# Altium project LogicsOnly.PrjPcb
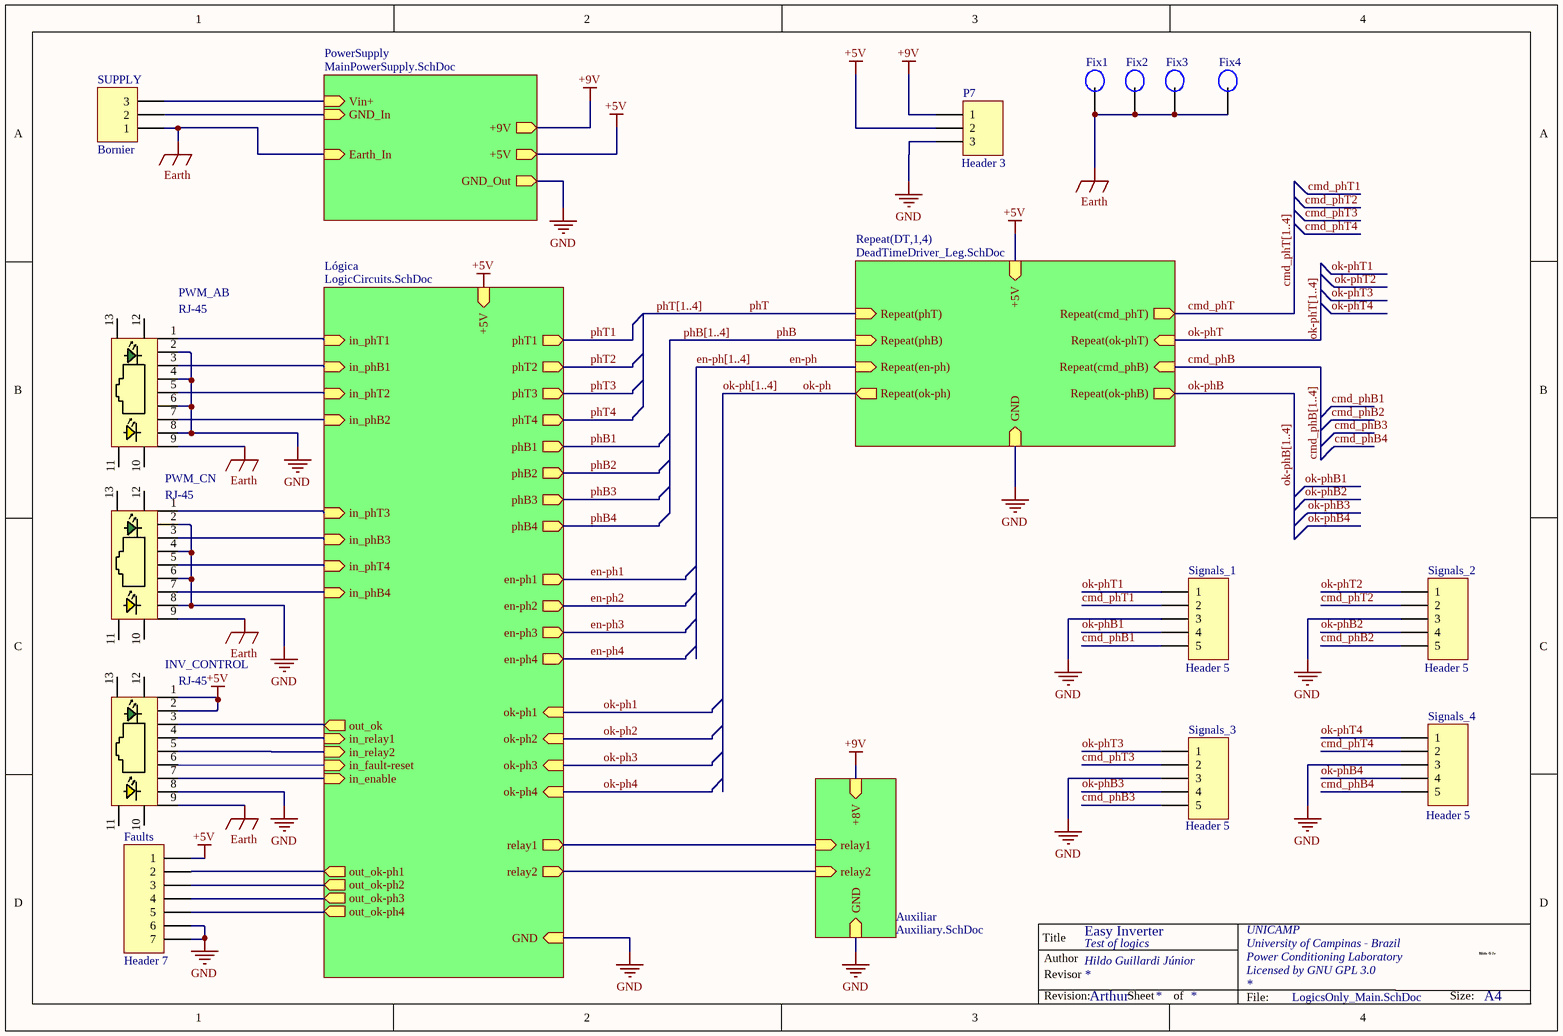
[diagram p0: LogicsOnly_Main.SchDoc]
5 sheets, 236 parts. Net scope: hierarchical (ports join the sheet entries above them; power ports are global).
Board file: LogicsOnly.PcbDoc
Sheets:
  LogicsOnly_Main.SchDoc
    Lógica = LogicCircuits.SchDoc
    Auxiliar = Auxiliary.SchDoc
    DT1 = DeadTimeDriver_Leg.SchDoc
    DT2 = DeadTimeDriver_Leg.SchDoc
    DT3 = DeadTimeDriver_Leg.SchDoc
    DT4 = DeadTimeDriver_Leg.SchDoc
    PowerSupply = MainPowerSupply.SchDoc

## Sheet LogicsOnly_Main.SchDoc: Test of logics
size A4; Author: Hildo Guillardi Júnior; Organization: UNICAMP; Address1: University of Campinas - Brazil; Address2: Power Conditioning Laboratory; Address3: Licensed by GNU GPL 3.0; Revision: Arthur; ProjectName: Easy Inverter

### Parts
Faults  value Header 7
Fix1  (no value)  [Pino]
Fix2  (no value)  [Pino]
Fix3  (no value)  [Pino]
Fix4  (no value)  [Pino]
INV_CONTROL  value RJ-45  [RJ-45]
P7  value Header 3  [HDR1X3]
PWM_AB  value RJ-45  [RJ-45]
PWM_CN  value RJ-45  [RJ-45]
Signals_1  value Header 5  [HDR1X5]
Signals_2  value Header 5  [HDR1X5]
Signals_3  value Header 5  [HDR1X5]
Signals_4  value Header 5  [HDR1X5]
SUPPLY  value Bornier  [3 Pin  Borner]

### Sub-sheets
Auxiliar = Auxiliary.SchDoc: relay1 (in), relay2 (in), GND (in), +8V (in)
Lógica = LogicCircuits.SchDoc: +5V (in), GND (in), out_ok-ph1 (out), out_ok-ph2 (out), ok-ph1 (in), out_ok-ph3 (out), out_ok-ph4 (out), en-ph1 (out), en-ph2 (out), en-ph3 (out), en-ph4 (out), in_enable (in), in_fault-reset (in), in_relay1 (in), relay1 (out), relay2 (out), out_ok (out), ok-ph2 (in), ok-ph3 (in), ok-ph4 (in), phB1 (out), phB2 (out), phT1 (out), phT2 (out), phT3 (out), phB3 (out), phT4 (out), phB4 (out), in_phT1 (in), in_phB1 (in), in_phT2 (in), in_phB2 (in), in_phT4 (in), in_phB4 (in), in_phT3 (in), in_phB3 (in), in_relay2 (in)
PowerSupply = MainPowerSupply.SchDoc: Earth_In (in), +9V (out), +5V (out), GND_Out (out), GND_In (in), Vin+ (in)
Repeat(DT,1,4) = DeadTimeDriver_Leg.SchDoc: Repeat(ok-ph) (out), Repeat(cmd_phT) (out), Repeat(phB) (in), Repeat(ok-phT) (in), Repeat(phT) (in), GND (in), +5V (in), Repeat(ok-phB) (out), Repeat(en-ph) (in), Repeat(cmd_phB) (in)

### Nets
+5V: Faults.1 INV_CONTROL.1 INV_CONTROL.2 P7.2 ; sheet Lógica/+5V, sheet Repeat(DT,1,4)/+5V, sheet PowerSupply/+5V
+9V: P7.1 ; sheet Auxiliar/+8V, sheet PowerSupply/+9V
Earth: Fix1.0 Fix2.0 Fix3.0 Fix4.0 INV_CONTROL.9 PWM_AB.9 PWM_CN.9 SUPPLY.1 ; sheet PowerSupply/Earth_In
GND: Faults.6 Faults.7 INV_CONTROL.8 P7.3 PWM_AB.2 PWM_AB.4 PWM_AB.6 PWM_AB.8 PWM_CN.2 PWM_CN.4 PWM_CN.6 PWM_CN.8 Signals_1.3 Signals_2.3 Signals_3.3 Signals_4.3 SUPPLY.2 ; sheet Lógica/GND, sheet Auxiliar/GND, sheet Repeat(DT,1,4)/GND, sheet PowerSupply/GND_Out, sheet PowerSupply/GND_In  [project net 0]
cmd_phB: sheet Repeat(DT,1,4)/Repeat(cmd_phB)
cmd_phB1: Signals_1.5
cmd_phB2: Signals_2.5
cmd_phB3: Signals_3.5
cmd_phB4: Signals_4.5
cmd_phT: sheet Repeat(DT,1,4)/Repeat(cmd_phT)
cmd_phT1: Signals_1.2
cmd_phT2: Signals_2.2
cmd_phT3: Signals_3.2
cmd_phT4: Signals_4.2
en-ph: sheet Repeat(DT,1,4)/Repeat(en-ph)
en-ph1: sheet Lógica/en-ph1, sheet Lógica/en-ph2  [also labelled en-ph2]
en-ph3: sheet Lógica/en-ph3, sheet Lógica/en-ph4  [also labelled en-ph4]
ok-ph: sheet Repeat(DT,1,4)/Repeat(ok-ph)
ok-phB: sheet Repeat(DT,1,4)/Repeat(ok-phB)
ok-phB1: Signals_1.4
ok-phB2: Signals_2.4
ok-phB3: Signals_3.4
ok-phB4: Signals_4.4
ok-phT: sheet Repeat(DT,1,4)/Repeat(ok-phT)
ok-phT1: Signals_1.1
ok-phT2: Signals_2.1
ok-phT3: Signals_3.1
ok-phT4: Signals_4.1
phB: sheet Repeat(DT,1,4)/Repeat(phB)
phT: sheet Repeat(DT,1,4)/Repeat(phT)
NetCin3_1: SUPPLY.3 ; sheet PowerSupply/Vin+
NetFaults_2: Faults.2 ; sheet Lógica/out_ok-ph1
NetFaults_3: Faults.3 ; sheet Lógica/out_ok-ph2
NetFaults_4: Faults.4 ; sheet Lógica/out_ok-ph3
NetFaults_5: Faults.5 ; sheet Lógica/out_ok-ph4
NetINV_CONTROL_3: INV_CONTROL.3 ; sheet Lógica/out_ok
NetINV_CONTROL_4: INV_CONTROL.4 ; sheet Lógica/in_relay1
NetINV_CONTROL_5: INV_CONTROL.5 ; sheet Lógica/in_relay2
NetINV_CONTROL_6: INV_CONTROL.6 ; sheet Lógica/in_fault-reset
NetINV_CONTROL_7: INV_CONTROL.7 ; sheet Lógica/in_enable
NetPWM_AB_1: PWM_AB.1 ; sheet Lógica/in_phT1
NetPWM_AB_3: PWM_AB.3 ; sheet Lógica/in_phB1
NetPWM_AB_5: PWM_AB.5 ; sheet Lógica/in_phT2
NetPWM_AB_7: PWM_AB.7 ; sheet Lógica/in_phB2
NetPWM_CN_1: PWM_CN.1 ; sheet Lógica/in_phT3
NetPWM_CN_3: PWM_CN.3 ; sheet Lógica/in_phB3
NetPWM_CN_5: PWM_CN.5 ; sheet Lógica/in_phT4
NetPWM_CN_7: PWM_CN.7 ; sheet Lógica/in_phB4
NetR2_1: sheet Lógica/relay1, sheet Auxiliar/relay1
NetR4_1: sheet Lógica/relay2, sheet Auxiliar/relay2

Not connected (* = marked no-connect by the designer): INV_CONTROL 10 11 12 13; PWM_AB 10 11 12 13; PWM_CN 10 11 12 13

### Buses and harness runs
bus cmd_phB[1..4]
bus cmd_phT[1..4]
bus en-ph[1..4]
bus ok-ph[1..4]
bus ok-phB[1..4]
bus ok-phT[1..4]
bus phB[1..4]
bus phT[1..4]

### Notes on the sheet
- Title
- Author
- Revisor
- Hildo G Jr
- Revision:
- Sheet
- of
- File:
- Size:
- A4
- HGJr

### Library data of the parts
Faults = Header 7: Header, 7-Pin
Fix1-Fix4 = Pino: Value: Pin
INV_CONTROL PWM_AB PWM_CN = RJ-45: pn: A-2004-2-4-LPS-N-R
P7 = Header 3: Header, 3-Pin
Signals_1-Signals_4 = Header 5: Header, 5-Pin
SUPPLY = Header 3: Header, 3-Pin; pn: 1935174

## Sheet LogicCircuits.SchDoc: Logic circuits
size A4; CheckedBy: Joel Guerreiro; Author: Hildo Guillardi Júnior; Organization: UNICAMP / LCEE; Address1: University of Campinas - Brazil; Address2: Power Conditioning Laboratory; Address3: Licensed by GNU GPL 3.0; Revision: Joel Guerreiro; ProjectName: Easy Inverter
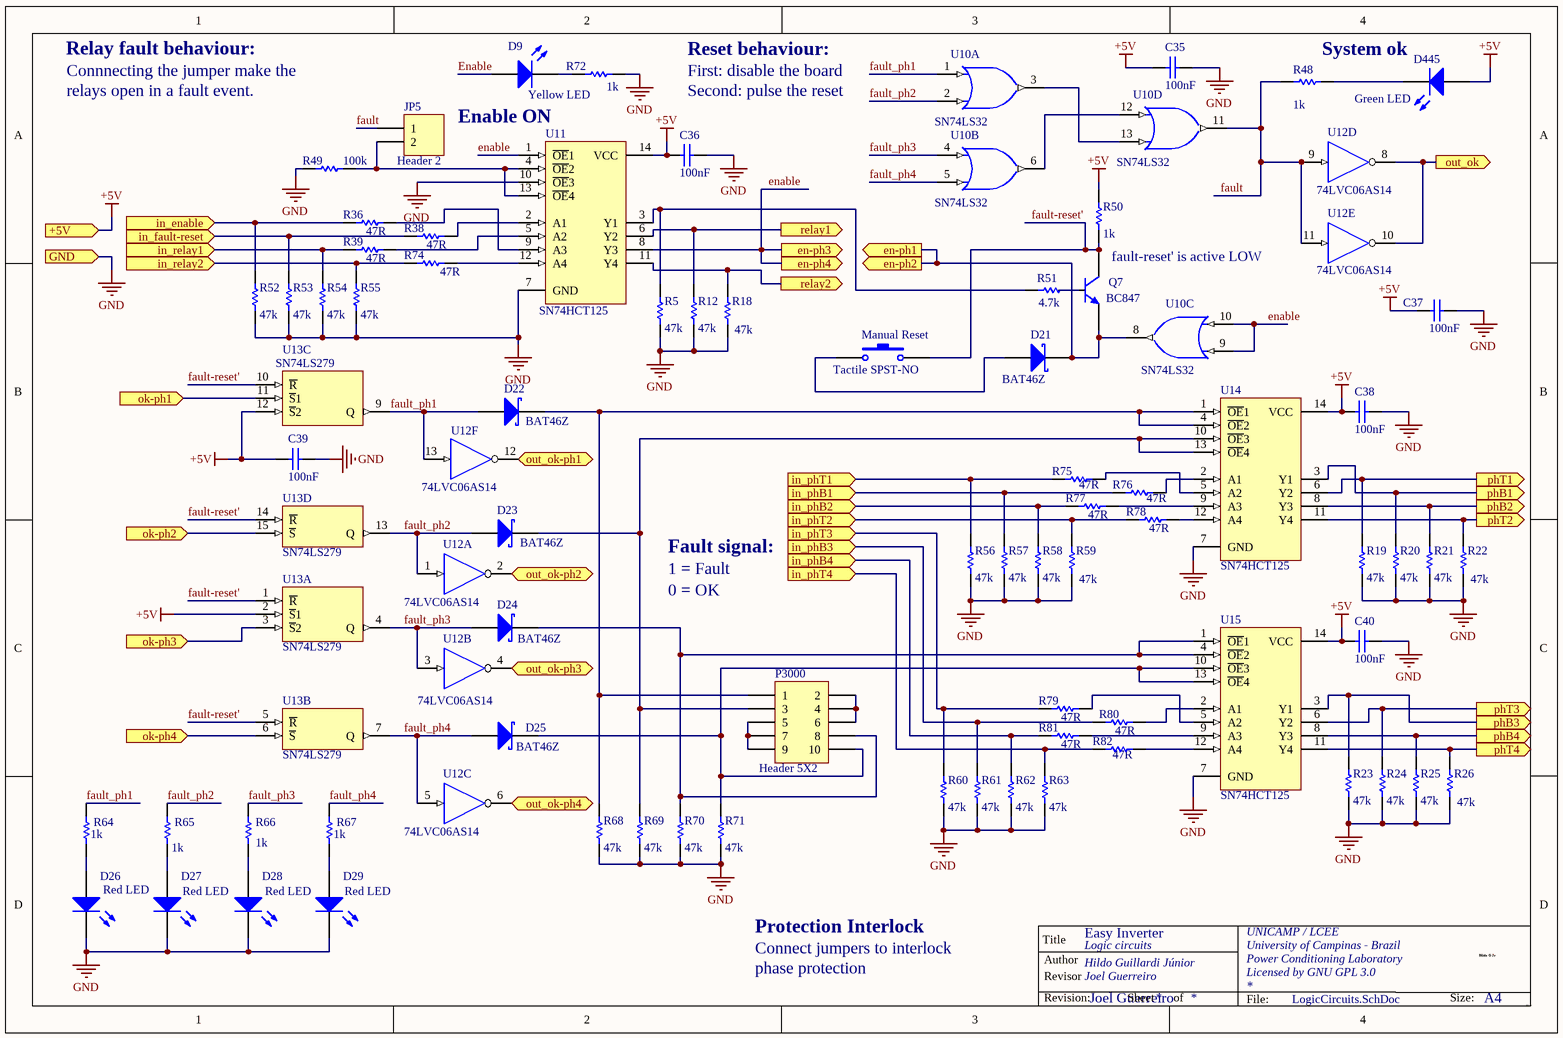
[diagram p1: LogicCircuits.SchDoc]

### Parts
C35  value 100nF  [0805_W]
C36  value 100nF  [0805_W]
C37  value 100nF  [0805_W]
C38  value 100nF  [0805_W]
C39  value 100nF  [0805_W]
C40  value 100nF  [0805_W]
D9  value Yellow LED  [LED_0805]
D21  value BAT46Z  [SOD-123]
D22  value BAT46Z  [SOD-123]
D23  value BAT46Z  [SOD-123]
D24  value BAT46Z  [SOD-123]
D25  value BAT46Z  [SOD-123]
D26  value Red LED  [LED_0805]
D27  value Red LED  [LED_0805]
D28  value Red LED  [LED_0805]
D29  value Red LED  [LED_0805]
D445  value Green LED  [LED_0805]
JP5  value Header 2  [HDR1X2]
Manual_Reset  value Tactile SPST-NO  [Tactile SPST-NO]
P3000  value Header 5X2  [HDR2X5]
Q7  value BC847  [SOT-23-TT3_N]
R5  value 47k  [0805_W]
R12  value 47k  [0805_W]
R18  value 47k  [0805_W]
R19  value 47k  [0805_W]
R20  value 47k  [0805_W]
R21  value 47k  [0805_W]
R22  value 47k  [0805_W]
R23  value 47k  [0805_W]
R24  value 47k  [0805_W]
R25  value 47k  [0805_W]
R26  value 47k  [0805_W]
R36  value 47R  [0805_W]
R38  value 47R  [0805_W]
R39  value 47R  [0805_W]
R48  value 1k  [0805_W]
R49  value 100k  [0805_W]
R50  value 1k  [0805_W]
R51  value 4.7k  [0805_W]
R52  value 47k  [0805_W]
R53  value 47k  [0805_W]
R54  value 47k  [0805_W]
R55  value 47k  [0805_W]
R56  value 47k  [0805_W]
R57  value 47k  [0805_W]
R58  value 47k  [0805_W]
R59  value 47k  [0805_W]
R60  value 47k  [0805_W]
R61  value 47k  [0805_W]
R62  value 47k  [0805_W]
R63  value 47k  [0805_W]
R64  value 1k  [0805_W]
R65  value 1k  [0805_W]
R66  value 1k  [0805_W]
R67  value 1k  [0805_W]
R68  value 47k  [0805_W]
R69  value 47k  [0805_W]
R70  value 47k  [0805_W]
R71  value 47k  [0805_W]
R72  value 1k  [0805_W]
R74  value 47R  [0805_W]
R75  value 47R  [0805_W]
R76  value 47R  [0805_W]
R77  value 47R  [0805_W]
R78  value 47R  [0805_W]
R79  pn: 47R  [0805_W]
R80  value 47R  [0805_W]
R81  value 47R  [0805_W]
R82  value 47R  [0805_W]
U10  value SN74LS32  [SO14-Wide]  (parts A,B,C,D of 4)
U11  value SN74HCT125  [SO14-Wide]
U12  value 74LVC06AS14  [SOIC-14N]  (parts A,B,C,D,E,F of 6)
U13  value SN74LS279  (parts A,B,C,D of 4)
U14  value SN74HCT125  [SO14-Wide]
U15  value SN74HCT125  [SO14-Wide]

### Ports
+5V (in), en-ph1 (out), en-ph2 (out), en-ph3 (out), en-ph4 (out), GND (in), in_enable (in), in_fault-reset (in), in_phB1 (in), in_phB2 (in), in_phB3 (in), in_phB4 (in), in_phT1 (in), in_phT2 (in), in_phT3 (in), in_phT4 (in), in_relay1 (in), in_relay2 (in), ok-ph1 (in), ok-ph2 (in), ok-ph3 (in), ok-ph4 (in), out_ok (out), out_ok-ph1 (out), out_ok-ph2 (out), out_ok-ph3 (out), out_ok-ph4 (out), phB1 (out), phB2 (out), phB3 (out), phB4 (out), phT1 (out), phT2 (out), phT3 (out), phT4 (out), relay1 (out), relay2 (out)

### Nets
+5V: C35.1 C36.1 C37.1 C38.1 C39.1 C40.1 D445.1(A) R50.2 U10.14(VCC) U11.14(VCC) U12.14(VCC) U13.2(~{S}1) U13.12(~{S}2) U13.16(VCC) U14.14(VCC) U15.14(VCC) ; port +5V
GND: C35.2 C36.2 C37.2 C38.2 C39.2 C40.2 D26.2(K) D27.2(K) D28.2(K) D29.2(K) R5.1 R12.1 R18.1 R19.1 R20.1 R21.1 R22.1 R23.1 R24.1 R25.1 R26.1 R49.2 R52.1 R53.1 R54.1 R55.1 R56.1 R57.1 R58.1 R59.1 R60.1 R61.1 R62.1 R63.1 R68.1 R69.1 R70.1 R71.1 R72.2 U10.7(GND) U11.7(GND) U11.10(~{OE}3) U12.7(GND) U13.8(GND) U14.7(GND) U15.7(GND) ; port GND  [project net 0]
en-ph1: D21.2(K) Q7.2(E) U10.8(3Y) ; port en-ph1, port en-ph2
enable: D9.1(A) U10.9(3A) U10.10(3B) U11.1(~{OE}1) U11.8(Y3) ; port en-ph3, port en-ph4  [project net en-ph3]
fault: JP5.1 R48.1 U10.11(4Y) U12.9(4A) U12.11(5A)
fault-reset': Manual_Reset.1 Q7.3(C) R50.1 U13.1(~{R}) U13.5(~{R}) U13.10(~{R}) U13.14(~{R})
fault_ph1: D22.1(A) R64.2 U10.1(1A) U12.13(6A) U13.9(Q)
fault_ph2: D23.1(A) R65.2 U10.2(1B) U12.1(1A) U13.13(Q)
fault_ph3: D24.1(A) R66.2 U10.4(2A) U12.3(2A) U13.4(Q)
fault_ph4: D25.1(A) R67.2 U10.5(2B) U12.5(3A) U13.7(Q)
ok-ph1: U13.11(~{S}1) ; port ok-ph1
ok-ph2: U13.15(~{S}) ; port ok-ph2
ok-ph3: U13.3(~{S}2) ; port ok-ph3
ok-ph4: U13.6(~{S}) ; port ok-ph4
phB: R20.2 U14.3(Y1) ; port phB1
phB: R21.2 U14.8(Y3) ; port phB2  [a separate net that carries the same name]
phB: R23.2 U15.3(Y1) ; port phB3  [a separate net that carries the same name]
phB: R25.2 U15.8(Y3) ; port phB4  [a separate net that carries the same name]
phT: R22.2 U14.11(Y4) ; port phT2
phT: R19.2 U14.6(Y2) ; port phT1  [a separate net that carries the same name]
phT: R26.2 U15.11(Y4) ; port phT4  [a separate net that carries the same name]
phT: R24.2 U15.6(Y2) ; port phT3  [a separate net that carries the same name]
NetD9_2: D9.2(K) R72.1
NetD21_1: D21.1(A) Manual_Reset.2
NetD22_2: D22.2(K) P3000.1 R68.2 U14.1(~{OE}1) U14.4(~{OE}2)
NetD23_2: D23.2(K) P3000.3 R69.2 U14.10(~{OE}3) U14.13(~{OE}4)
NetD24_2: D24.2(K) P3000.8 R70.2 U15.1(~{OE}1) U15.4(~{OE}2)
NetD25_2: D25.2(K) P3000.10 R71.2 U15.10(~{OE}3) U15.13(~{OE}4)
NetD26_1: D26.1(A) R64.1
NetD27_1: D27.1(A) R65.1
NetD28_1: D28.1(A) R66.1
NetD29_1: D29.1(A) R67.1
NetD445_2: D445.2(K) R48.2
NetFaults_2: U12.12(6~{Y}) ; port out_ok-ph1
NetFaults_3: U12.2(1~{Y}) ; port out_ok-ph2
NetFaults_4: U12.4(2~{Y}) ; port out_ok-ph3
NetFaults_5: U12.6(3~{Y}) ; port out_ok-ph4
NetINV_CONTROL_3: U12.8(4~{Y}) U12.10(5~{Y}) ; port out_ok
NetINV_CONTROL_4: R39.2 R54.2 ; port in_relay1
NetINV_CONTROL_5: R55.2 R74.2 ; port in_relay2
NetINV_CONTROL_6: R38.2 R53.2 ; port in_fault-reset
NetINV_CONTROL_7: R36.2 R52.2 ; port in_enable
NetJP5_2: JP5.2 R49.1 U11.4(~{OE}2) U11.13(~{OE}4)
NetP3000_2: P3000.2 P3000.4 P3000.6
NetP3000_5: P3000.5 P3000.7 P3000.9
NetPWM_AB_1: R56.2 R75.2 ; port in_phT1
NetPWM_AB_3: R57.2 R76.2 ; port in_phB1
NetPWM_AB_5: R59.2 R78.2 ; port in_phT2
NetPWM_AB_7: R58.2 R77.2 ; port in_phB2
NetPWM_CN_1: R60.2 R79.2 ; port in_phT3
NetPWM_CN_3: R61.2 R80.2 ; port in_phB3
NetPWM_CN_5: R63.2 R82.2 ; port in_phT4
NetPWM_CN_7: R62.2 R81.2 ; port in_phB4
NetQ7_1: Q7.1(B) R51.2
NetR2_1: R12.2 U11.6(Y2) ; port relay1
NetR4_1: R18.2 U11.11(Y4) ; port relay2
NetR5_2: R5.2 R51.1 U11.3(Y1)
NetR36_1: R36.1 U11.9(A3)
NetR38_1: R38.1 U11.2(A1)
NetR39_1: R39.1 U11.5(A2)
NetR74_1: R74.1 U11.12(A4)
NetR75_1: R75.1 U14.5(A2)
NetR76_1: R76.1 U14.2(A1)
NetR77_1: R77.1 U14.9(A3)
NetR78_1: R78.1 U14.12(A4)
NetR79_1: R79.1 U15.5(A2)
NetR80_1: R80.1 U15.2(A1)
NetR81_1: R81.1 U15.9(A3)
NetR82_1: R82.1 U15.12(A4)
NetU10_3: U10.3(1Y) U10.13(4B)
NetU10_6: U10.6(2Y) U10.12(4A)

### Notes on the sheet
- Relay fault behaviour:
- Connnecting the jumper make the
- relays open in a fault event.
- Reset behaviour:
- First: disable the board
- Second: pulse the reset
- System ok
- Enable ON
- fault-reset' is active LOW
- Fault signal:
- 1 = Fault
- 0 = OK
- Protection Interlock
- Connect jumpers to interlock
- phase protection
- Title
- Author
- Revisor
- Hildo G Jr
- Revision:
- Sheet
- of
- File:
- Size:
- A4
- HGJr

### Library data of the parts
C35 C36 = Capacitor_nao_polarizado: Capacitor nao polarizado; Value: Value
C37-C40 = Capacitor_nao_polarizado: Capacitor nao polarizado; pn: C0805C104K8RACTU
D9 = LED0: Typical INFRARED GaAs LED; pn: SML-LXR85YC-TR
D21 D23-D25 = D Schottky: Schottky Diode; np: BAT46ZFILM
D22 = D Schottky: Schottky Diode; pn: BAT46ZFILM
D26-D29 = LED0: Typical INFRARED GaAs LED; pn: SML-LXR85IC-TR
D445 = LED0: Typical INFRARED GaAs LED; pn: SML-LXR85GC-TR
JP5 = Header 2: Header, 2-Pin
Manual_Reset = SW-PB: Switch; pn: FSM4JH
P3000 = Header 5X2: Header, 5-Pin, Dual row
Q7 = BC847: NPN General-purpose Transistor; pn: BC847BLT1G
R5 R12 R18-R26 R52-R55 R68-R71 = Res_0805: Resistor; pn: RMCF0805JT47K0
R36 R38 R39 R74-R78 R80-R82 = Res_0805: Resistor; pn: RMCF0805JT47R0
R48 R50 R64-R67 R72 = Res_0805: Resistor; pn: RMCF0805JT1K00
R49 R56-R63 = Res_0805: Resistor; Manufacturer: Generic Components; Class: Passive; Published: 08/06/2000; Publisher: Altium Hobart Technology Centre; SubClass: Resistor; Value: Value
R51 = Res_0805: Resistor; pn: RMCF0805JT4K70
R79 = Res_0805: Resistor; Published: RMCF0805JT47R0
U10 = HD74HC32FP: Quad 2-Input OR Gates; pn: SN74LS32NSR
U11 = M74HC125M1R: Quad Bus Buffer (3-State); pn: SN74HCT125DR
U12 = HD74LV06AFP: Hex Inverter Buffers / Drivers with Open Drain Outputs; Publisher: 74LVC06AS14-13
U13 = SN74LS279AD: Quadruple S-R Latches; pn: SN74LS279ANSR
U14 U15 = M74HC125M1R: Quad Bus Buffer (3-State); Publisher: SN74HCT125DR

## Sheet Auxiliary.SchDoc: Relays & auxiliary circuits
size A4; CheckedBy: Fellipe; Author: Hildo Guillardi Júnior; Organization: UNICAMP / LCEE; Address1: University of Campinas - Brazil; Address2: Power Conditioning Laboratory; Address3: Licensed by GNU GPL 3.0; ProjectName: Easy Inverter
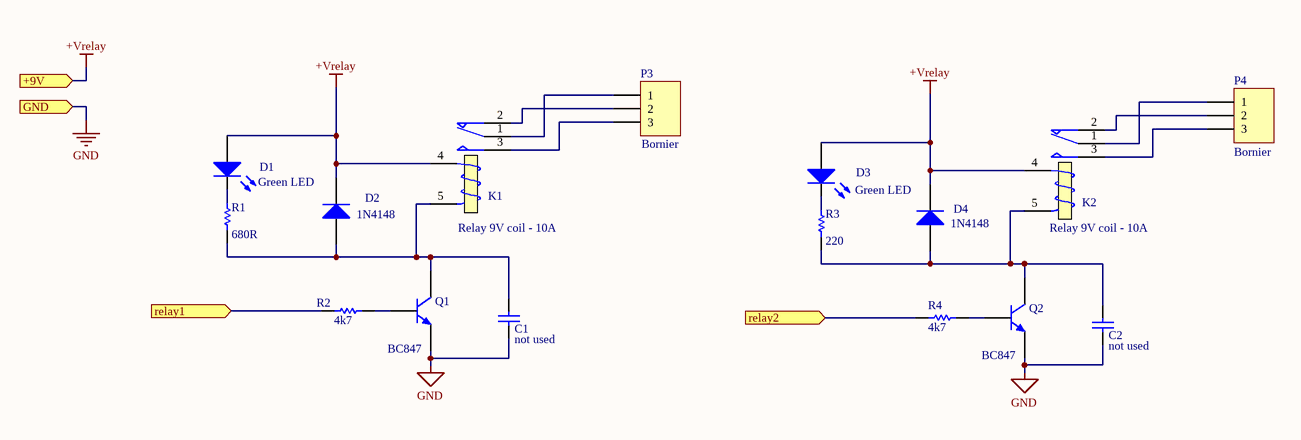
[diagram p2: Auxiliary.SchDoc]

### Parts
C1  value not used  [0805_W]
C2  value not used  [0805_W]
D1  value Green LED  [LED_0805]
D2  value 1N4148  [SOD-123]
D3  value Green LED  [LED_0805]
D4  value 1N4148  [SOD-123]
K1  value Relay 9V coil - 10A  [Relay - SPDT]
K2  value Relay 9V coil - 10A  [Relay - SPDT]
P3  value Bornier  [KK-3_G]
P4  value Bornier  [KK-3_G]
Q1  value BC847  [SOT-23-TT3_L]
Q2  value BC847  [SOT-23-TT3_L]
R1  value 680R  [0805_W]
R2  value 4k7  [0805_W]
R3  value 220  [0805_W]
R4  value 4k7  [0805_W]

### Ports
+9V (in), GND (in), relay1 (in), relay2 (in)

### Nets
+Vrelay: D1.1(A) D2.2(K) D3.1(A) D4.2(K) K1.4(T1) K2.4(T1) ; port +9V
GND: C1.1 C2.1 Q1.2(E) Q2.2(E) ; port GND  [project net 0]
NetC1_2: C1.2 D2.1(A) K1.5(T2) Q1.3(C) R1.2
NetC2_2: C2.2 D4.1(A) K2.5(T2) Q2.3(C) R3.2
NetD1_2: D1.2(K) R1.1
NetD3_2: D3.2(K) R3.1
NetK1_1: K1.1(COM) P3.1
NetK1_2: K1.2(NC) P3.2
NetK1_3: K1.3(NO) P3.3
NetK2_1: K2.1(COM) P4.1
NetK2_2: K2.2(NC) P4.2
NetK2_3: K2.3(NO) P4.3
NetQ1_1: Q1.1(B) R2.2
NetQ2_1: Q2.1(B) R4.2
NetR2_1: R2.1 ; port relay1
NetR4_1: R4.1 ; port relay2

### Notes on the sheet
- Title
- Author
- Revisor
- Hildo G Jr
- Revision:
- Sheet
- of
- File:
- Size:
- A4
- HGJr

### Library data of the parts
C1 C2 = Cap: Capacitor
D1 D3 = LED0: as D445 on sheet LogicCircuits
D2 D4 = Diode 1N4148: High Conductance Fast Diode; pn: 1N4148W-TP
K1 K2 = Relay: SPDT Relay; pn: G5LE-14-DC9
P3 P4 = Header 3: Header, 3-Pin; pn: 1935174
Q1 Q2 = BC847: as Q7 on sheet LogicCircuits
R1 R3 = Res_0805: Resistor; pn: RMCF0805JT680R
R2 R4 = Res1: Resistor; pn: RMCF0805JT4K70

## Sheet DeadTimeDriver_Leg.SchDoc: Dead time & interlock
size A4; CheckedBy: Hildo / Joel; Author: Fellipe; Organization: UNICAMP / LCEE; Address1: University of Campinas - Brazil; Address2: Power Conditioning Laboratory; Address3: Licensed by GNU GPL 3.0; ProjectName: Easy Inverter
Used 4 times, as channels DT1, DT2, DT3, DT4. Parts and nets are listed once, with the designators drawn on the sheet.
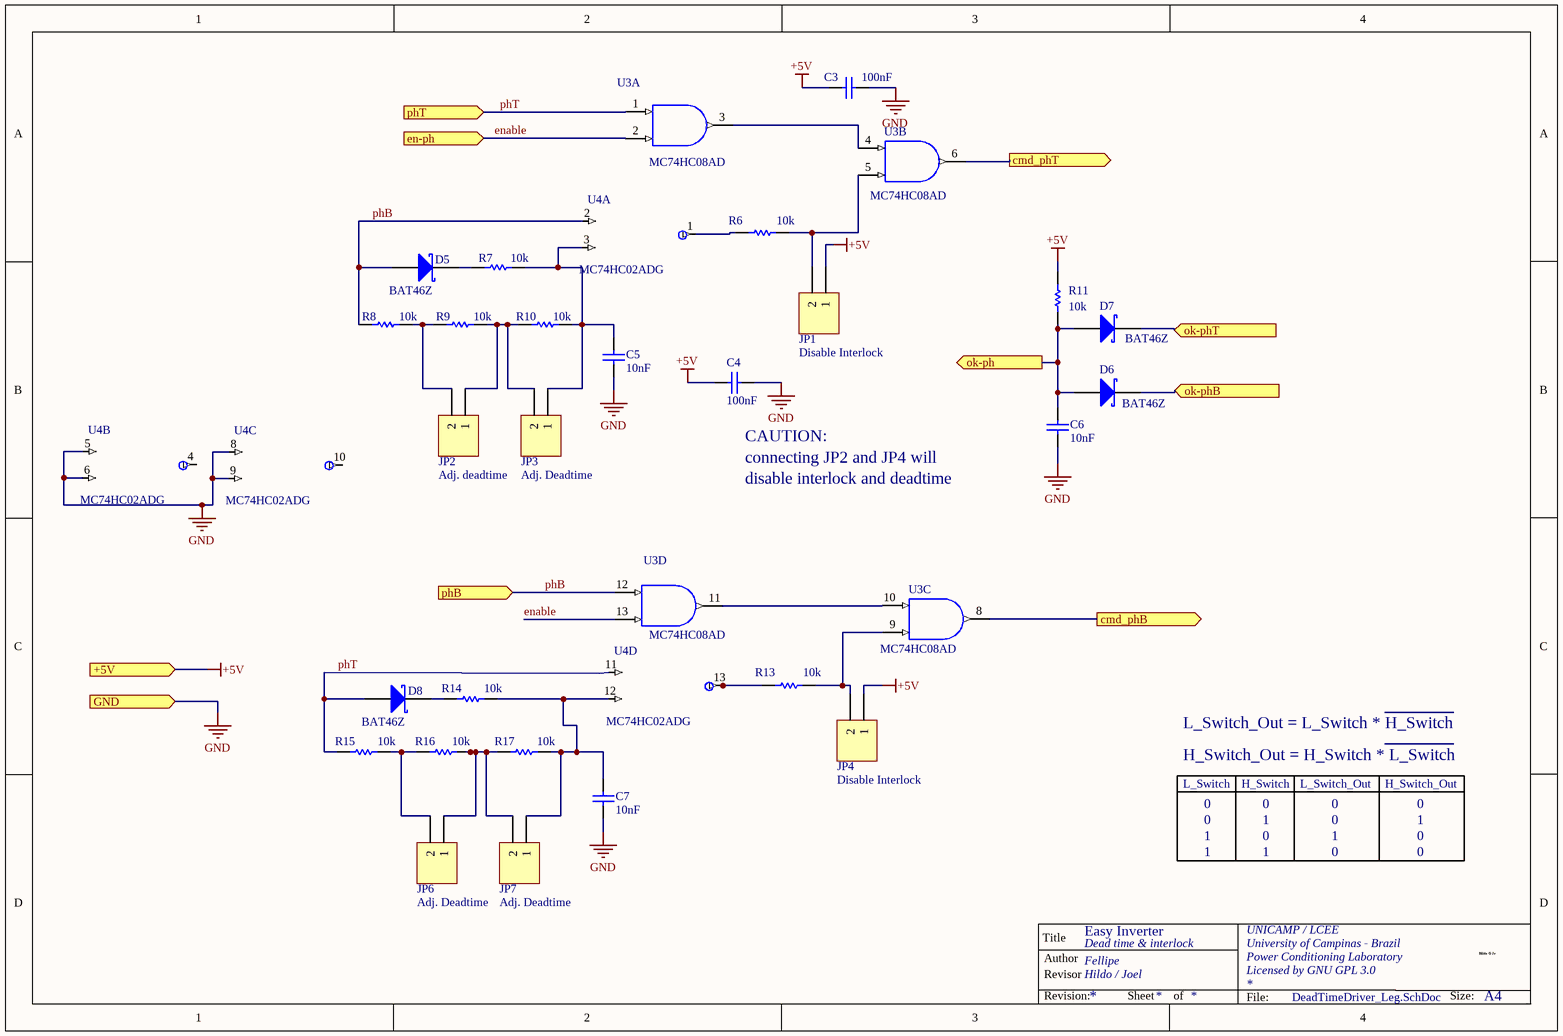
[diagram p3: DeadTimeDriver_Leg.SchDoc]

### Parts
C3  value 100nF  [0805_W]
C4  value 100nF  [0805_W]
C5  value 10nF  [0805_W]
C6  value 10nF  [0805_W]
C7  value 10nF  [0805_W]
D5  value BAT46Z  [SOD-123]
D6  value BAT46Z  [SOD-123]
D7  value BAT46Z  [SOD-123]
D8  value BAT46Z  [SOD-123]
JP1  Disable Interlock  [Jumper]
JP2  Adj. deadtime  [Jumper]
JP3  Adj. Deadtime  [Jumper]
JP4  Disable Interlock  [Jumper]
JP6  Adj. Deadtime  [Jumper]
JP7  Adj. Deadtime  [Jumper]
R6  value 10k  [0805_W]
R7  value 10k  [0805_W]
R8  value 10k  [0805_W]
R9  value 10k  [0805_W]
R10  value 10k  [0805_W]
R11  value 10k  [0805_W]
R13  value 10k  [0805_W]
R14  value 10k  [0805_W]
R15  value 10k  [0805_W]
R16  value 10k  [0805_W]
R17  value 10k  [0805_W]
U3  value MC74HC08AD  [SOIC-14N]  (parts A,B,C,D of 4)
U4  value MC74HC02ADG  [SOIC-14N]  (parts A,B,C,D of 4)

### Ports
+5V (in), cmd_phB (out), cmd_phT (out), en-ph (in), GND (in), ok-ph (out), ok-phB (in), ok-phT (in), phB (in), phT (in)

### Nets
+5V: C3.1 C4.1 JP1.1 JP4.1 R11.2 U3.14(VDD) U4.14(VDD) ; port +5V
GND: C3.2 C4.2 C5.2 C6.2 C7.2 U3.7(GND) U4.5 U4.6 U4.7(GND) U4.8 U4.9 ; port GND
cmd_phB: U3.8(Y) ; port cmd_phB
cmd_phT: U3.6(Y) ; port cmd_phT
enable: U3.2(B) U3.13(B) ; port en-ph
ok-ph: C6.1 D6.1(A) D7.1(A) R11.1 ; port ok-ph
ok-phB: D6.2(K) ; port ok-phB
ok-phT: D7.2(K) ; port ok-phT
phB: D5.1(A) R8.1 U3.12(A) U4.2 ; port phB
phT: D8.1(A) R15.1 U3.1(A) U4.11 ; port phT
NetC5_1: C5.1 JP3.1 R7.2 R10.2 U4.3
NetC7_1: C7.1 JP7.1 R14.2 R17.2 U4.12
NetD5_2: D5.2(K) R7.1
NetD8_2: D8.2(K) R14.1
NetJP1_2: JP1.2 R6.2 U3.5(B)
NetJP2_1: JP2.1 JP3.2 R9.2 R10.1
NetJP2_2: JP2.2 R8.2 R9.1
NetJP4_2: JP4.2 R13.2 U3.9(A)
NetJP6_1: JP6.1 JP7.2 R16.2 R17.1
NetJP6_2: JP6.2 R15.2 R16.1
NetR6_1: R6.1 U4.1
NetR13_1: R13.1 U4.13
NetU3_3: U3.3(Y) U3.4(A)
NetU3_10: U3.10(B) U3.11(Y)

Not connected (* = marked no-connect by the designer): U4 4 10

### Channels
DT1: designators end in .DTA; ports +5V=+5V cmd_phB=cmd_phB1 cmd_phT=cmd_phT1 en-ph=en-ph1 GND=0 ok-ph=ok-ph1 ok-phB=ok-phB1 ok-phT=ok-phT1 phB=phB phT=phT
DT2: designators end in .DTB; ports +5V=+5V cmd_phB=cmd_phB2 cmd_phT=cmd_phT2 en-ph=en-ph1 GND=0 ok-ph=ok-ph2 ok-phB=ok-phB2 ok-phT=ok-phT2 phB=phB phT=phT
DT3: designators end in .DTC; ports +5V=+5V cmd_phB=cmd_phB3 cmd_phT=cmd_phT3 en-ph=en-ph3 GND=0 ok-ph=ok-ph3 ok-phB=ok-phB3 ok-phT=ok-phT3 phB=phB phT=phT
DT4: designators end in .DTD; ports +5V=+5V cmd_phB=cmd_phB4 cmd_phT=cmd_phT4 en-ph=en-ph3 GND=0 ok-ph=ok-ph4 ok-phB=ok-phB4 ok-phT=ok-phT4 phB=phB phT=phT

### Notes on the sheet
- (near C4) CAUTION:
- connecting JP2 and JP4 will
- disable interlock and deadtime
- L_Switch
- L_Switch_Out = L_Switch * H_Switch
- H_Switch_Out = H_Switch * L_Switch
- H_Switch
- L_Switch_Out
- H_Switch_Out
- 0
- 1
- Title
- Author
- Revisor
- Hildo G Jr
- Revision:
- Sheet
- of
- File:
- Size:
- A4
- HGJr

### Library data of the parts
C3 C4 = Capacitor_nao_polarizado: Capacitor nao polarizado; pn: 08053C104KAT2A
C5-C7 = Cap_0805: Capacitor; Published: 8-Jun-2000; LatestRevisionDate: 17-Jul-2002; LatestRevisionNote: Re-released for DXP Platform.; PackageReference: RAD-0.3; Publisher: Altium Limited; Value: Value
D5-D8 = D Schottky: Schottky Diode; pn: BAT46ZFILM
JP1-JP4 JP6 JP7 = Header 2: Header, 2-Pin; Value: solder jumper
R6-R11 R13-R17 = Res_0805: as R49 on sheet LogicCircuits; Published: 08/06/2000; Publisher: Altium Hobart Technology Centre; SubClass: Resistor; Value: Value
U3 = MC74HC08AD: Quad 2-Input AND Gate; pn: MC74HC08ADG
U4 = Double 2-input NOR: SN74AUP2G02DCUR; pn: MC74HC02ADG

## Sheet MainPowerSupply.SchDoc: Main power supply
size A4; CheckedBy: Hildo Guillardi Júnior; Author: Joel Guerreiro; Organization: UNICAMP / LCEE; Address1: University of Campinas - Brazil; Address2: Power Conditioning Laboratory; Address3: Licensed by GNU GPL 3.0; Revision: Hildo Guillardi Júnior; ProjectName: Easy Inverter
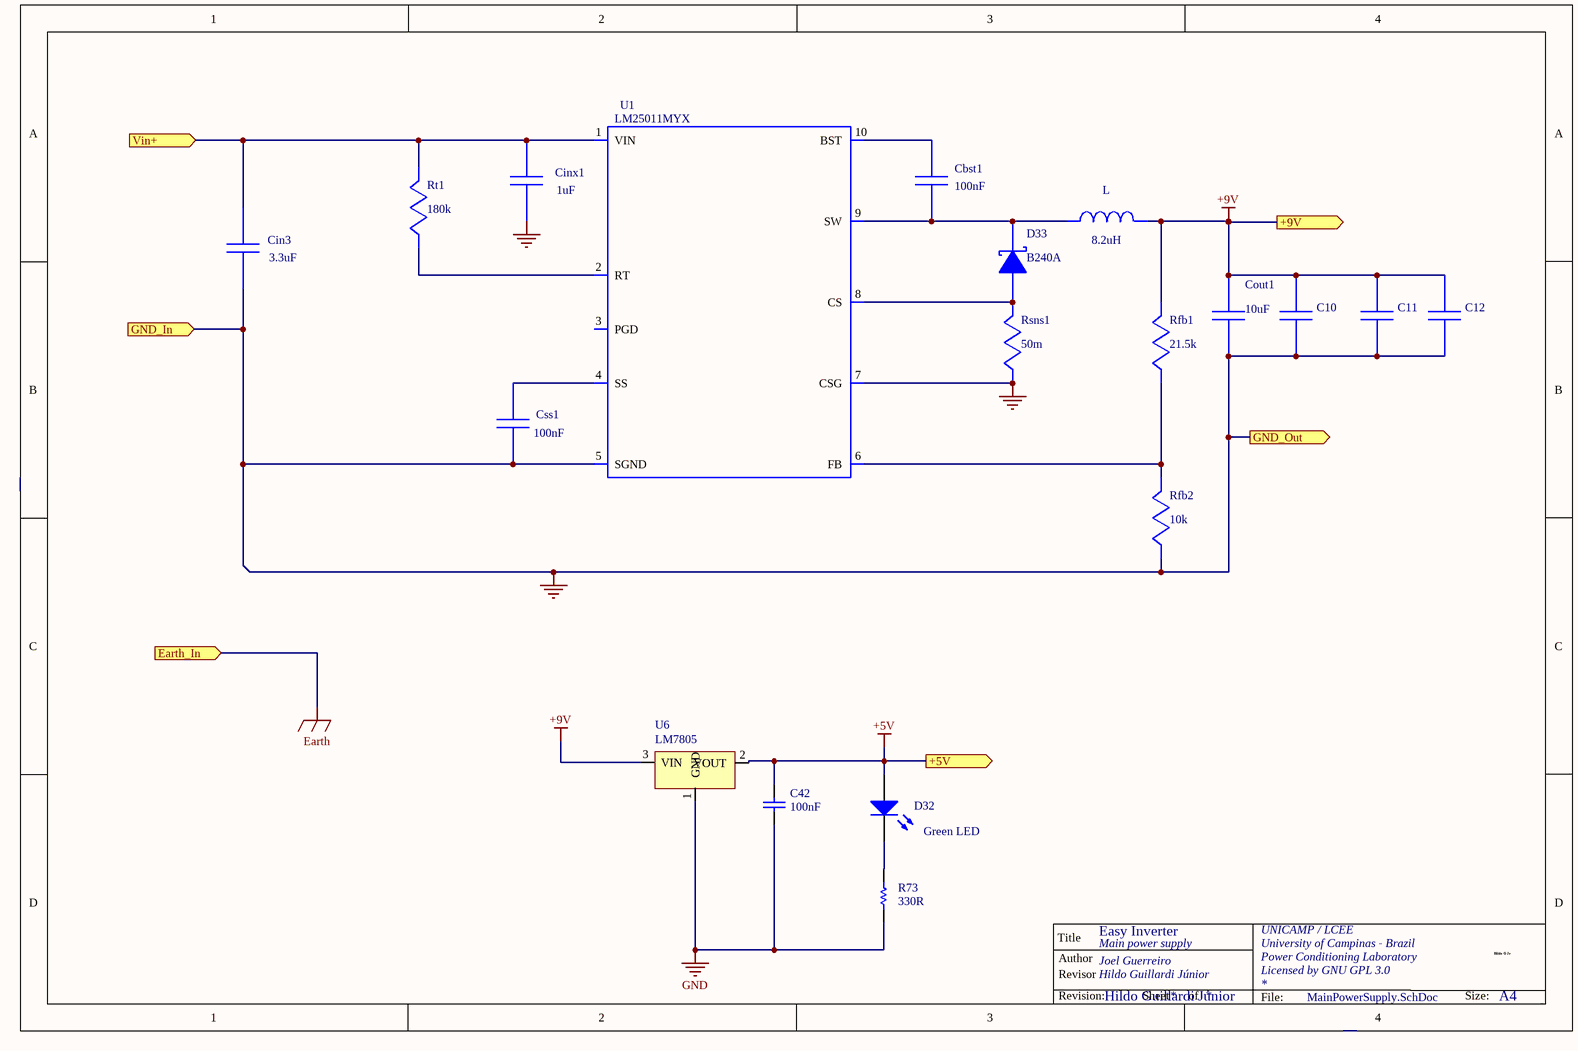
[diagram p4: MainPowerSupply.SchDoc]

### Parts
C10  (no value)  [0805_W]
C11  (no value)  [0805_W]
C12  (no value)  [0805_W]
C42  value 100nF  [0805_W]
Cbst1  value 100nF  [0805_W]
Cin3  value 3.3uF  [1210_W]
Cinx1  value 1uF  [0805_W]
Cout1  value 10uF  [0805_W]
Css1  value 100nF  [0805_W]
D32  value Green LED  [LED_0805]
D33  value B240A  [SOD-123]
L  value 8.2uH  [SRN8040T - Inductor]
R73  value 330R  [0805_W]
Rfb1  value 21.5k  [0805_W]
Rfb2  value 10k  [0805_W]
Rsns1  value 50m  [0805_W]
Rt1  value 180k  [0805_W]
U1  value LM25011MYX  [10MSOP]
U6  value LM7805  [LM7805]

### Ports
+5V (out), +9V (out), Earth_In (in), GND_In (in), GND_Out (out), Vin+ (in)

### Nets
0: C10.2 C11.2 C12.2 C42.2 Cin3.2 Cinx1.2 Cout1.2 Css1.2 R73.1 Rfb2.2 Rsns1.2 U1.5(SGND) U1.7(CSG) U6.1(GND) ; port GND_In, port GND_Out  [also labelled GND]
+5V: C42.1 D32.1(A) U6.2(VOUT) ; port +5V
+9V: C10.1 C11.1 C12.1 Cout1.1 L.2 Rfb1.1 U6.3(VIN) ; port +9V
NetCbst1_1: Cbst1.1 U1.10(BST)
NetCbst1_2: Cbst1.2 D33.2(K) L.1 U1.9(SW)
NetCin3_1: Cin3.1 Cinx1.1 Rt1.1 U1.1(VIN) ; port Vin+
NetCss1_1: Css1.1 U1.4(SS)
NetD32_2: D32.2(K) R73.2
NetD33_1: D33.1(A) Rsns1.1 U1.8(CS)
NetRfb1_2: Rfb1.2 Rfb2.1 U1.6(FB)
NetRt1_2: Rt1.2 U1.2(RT)

Not connected (* = marked no-connect by the designer): U1 3(PGD)

### Notes on the sheet
- Title
- Author
- Revisor
- Hildo G Jr
- Revision:
- Sheet
- of
- File:
- Size:
- A4
- HGJr

### Library data of the parts
C10-C12 = GRM21BR61C106KE15L: GRM21BR61C106KE1; Manufacturer Name: MuRata; PackageReference: GRM21BR61C106KE15L; Manufacturer Part Number: GRM21BR61C106KE15L; Value: Value
C42 = Capacitor_nao_polarizado: as C3 on sheet DeadTimeDriver_Leg
Cbst1 Css1 = CC0805KRX7R8BB104: CC0805KRX7R8BB10; pn: 08053C104KAT2A
Cin3 = C3225X7S2A335K200AB: C3225X7S2A335K20; Manufacturer Name: TDK; PackageReference: C3225X7S2A335K200AB; Manufacturer Part Number: C3225X7S2A335K200AB; Value: Value
Cinx1 = C1608X5R1H105K080AB: C1608X5R1H105K08; Manufacturer Name: TDK; PackageReference: C1608X5R1H105K080AB; Manufacturer Part Number: C1608X5R1H105K080AB; Value: Value
Cout1 = C0805C106K8PACTU: pn: C0805C106K8PACTU
D32 = LED0: as D445 on sheet LogicCircuits
D33 = B360A-13-F: pn: B360A-13-F
L = SRN8040-8R2Y: pn: SRN8040-8R2Y
R73 = Res_0805: Resistor; pn: RMCF0805JT330R
Rfb1 = CRCW040221K5FKED: Manufacturer Name: Vishay-Dale; PackageReference: CRCW040221K5FKED; Manufacturer Part Number: CRCW040221K5FKED; Value: Value
Rfb2 = CRCW040210K0FKED: Manufacturer Name: Vishay-Dale; PackageReference: CRCW040210K0FKED; Manufacturer Part Number: CRCW040210K0FKED; Value: Value
Rsns1 = CRM0805-FW-R050ELF: CRM0805-FW-R050E; Manufacturer Name: Bourns; PackageReference: CRM0805-FW-R050ELF; Manufacturer Part Number: CRM0805-FW-R050ELF; Value: Value
Rt1 = CRCW0402174KFKED: Manufacturer Name: Vishay-Dale; PackageReference: CRCW0402174KFKED; Manufacturer Part Number: CRCW0402174KFKED; Value: Value
U1 = LM25011MYX/NOPB: pn: LM25011MYX/NOPB
U6 = LM7805: pn: MC7805BDTG

## Nets that join several sheets
0: LogicsOnly_Main (17 pins), LogicCircuits (46 pins), Auxiliary (C1.1 C2.1 Q1.2 Q2.2), DT1 (11 pins), DT2 (11 pins), DT3 (11 pins), DT4 (11 pins), MainPowerSupply (14 pins)
+5V: LogicsOnly_Main (Faults.1 INV_CONTROL.1 INV_CONTROL.2 P7.2), LogicCircuits (16 pins), DT1 (7 pins), DT2 (7 pins), DT3 (7 pins), DT4 (7 pins), MainPowerSupply (C42.1 D32.1 U6.2)
+9V: LogicsOnly_Main (P7.1), MainPowerSupply (7 pins)
cmd_phB1: LogicsOnly_Main (Signals_1.5), DT1 (U3.DTA.8)
cmd_phB2: LogicsOnly_Main (Signals_2.5), DT2 (U3.DTB.8)
cmd_phB3: LogicsOnly_Main (Signals_3.5), DT3 (U3.DTC.8)
cmd_phB4: LogicsOnly_Main (Signals_4.5), DT4 (U3.DTD.8)
cmd_phT1: LogicsOnly_Main (Signals_1.2), DT1 (U3.DTA.6)
cmd_phT2: LogicsOnly_Main (Signals_2.2), DT2 (U3.DTB.6)
cmd_phT3: LogicsOnly_Main (Signals_3.2), DT3 (U3.DTC.6)
cmd_phT4: LogicsOnly_Main (Signals_4.2), DT4 (U3.DTD.6)
en-ph1: LogicCircuits (D21.2 Q7.2 U10.8), DT1 (U3.DTA.2 U3.DTA.13), DT2 (U3.DTB.2 U3.DTB.13)
en-ph3: LogicCircuits (5 pins), DT3 (U3.DTC.2 U3.DTC.13), DT4 (U3.DTD.2 U3.DTD.13)
NetCin3_1: LogicsOnly_Main (SUPPLY.3), MainPowerSupply (Cin3.1 Cinx1.1 Rt1.1 U1.1)
NetFaults_2: LogicsOnly_Main (Faults.2), LogicCircuits (U12.12)
NetFaults_3: LogicsOnly_Main (Faults.3), LogicCircuits (U12.2)
NetFaults_4: LogicsOnly_Main (Faults.4), LogicCircuits (U12.4)
NetFaults_5: LogicsOnly_Main (Faults.5), LogicCircuits (U12.6)
NetINV_CONTROL_3: LogicsOnly_Main (INV_CONTROL.3), LogicCircuits (U12.8 U12.10)
NetINV_CONTROL_4: LogicsOnly_Main (INV_CONTROL.4), LogicCircuits (R39.2 R54.2)
NetINV_CONTROL_5: LogicsOnly_Main (INV_CONTROL.5), LogicCircuits (R55.2 R74.2)
NetINV_CONTROL_6: LogicsOnly_Main (INV_CONTROL.6), LogicCircuits (R38.2 R53.2)
NetINV_CONTROL_7: LogicsOnly_Main (INV_CONTROL.7), LogicCircuits (R36.2 R52.2)
NetPWM_AB_1: LogicsOnly_Main (PWM_AB.1), LogicCircuits (R56.2 R75.2)
NetPWM_AB_3: LogicsOnly_Main (PWM_AB.3), LogicCircuits (R57.2 R76.2)
NetPWM_AB_5: LogicsOnly_Main (PWM_AB.5), LogicCircuits (R59.2 R78.2)
NetPWM_AB_7: LogicsOnly_Main (PWM_AB.7), LogicCircuits (R58.2 R77.2)
NetPWM_CN_1: LogicsOnly_Main (PWM_CN.1), LogicCircuits (R60.2 R79.2)
NetPWM_CN_3: LogicsOnly_Main (PWM_CN.3), LogicCircuits (R61.2 R80.2)
NetPWM_CN_5: LogicsOnly_Main (PWM_CN.5), LogicCircuits (R63.2 R82.2)
NetPWM_CN_7: LogicsOnly_Main (PWM_CN.7), LogicCircuits (R62.2 R81.2)
NetR2_1: LogicCircuits (R12.2 U11.6), Auxiliary (R2.1)
NetR4_1: LogicCircuits (R18.2 U11.11), Auxiliary (R4.1)
ok-ph1: LogicCircuits (U13.11), DT1 (C6.DTA.1 D6.DTA.1 D7.DTA.1 R11.DTA.1)
ok-ph2: LogicCircuits (U13.15), DT2 (C6.DTB.1 D6.DTB.1 D7.DTB.1 R11.DTB.1)
ok-ph3: LogicCircuits (U13.3), DT3 (C6.DTC.1 D6.DTC.1 D7.DTC.1 R11.DTC.1)
ok-ph4: LogicCircuits (U13.6), DT4 (C6.DTD.1 D6.DTD.1 D7.DTD.1 R11.DTD.1)
ok-phB1: LogicsOnly_Main (Signals_1.4), DT1 (D6.DTA.2)
ok-phB2: LogicsOnly_Main (Signals_2.4), DT2 (D6.DTB.2)
ok-phB3: LogicsOnly_Main (Signals_3.4), DT3 (D6.DTC.2)
ok-phB4: LogicsOnly_Main (Signals_4.4), DT4 (D6.DTD.2)
ok-phT1: LogicsOnly_Main (Signals_1.1), DT1 (D7.DTA.2)
ok-phT2: LogicsOnly_Main (Signals_2.1), DT2 (D7.DTB.2)
ok-phT3: LogicsOnly_Main (Signals_3.1), DT3 (D7.DTC.2)
ok-phT4: LogicsOnly_Main (Signals_4.1), DT4 (D7.DTD.2)
phB: LogicCircuits (R20.2 U14.3), DT1 (D5.DTA.1 R8.DTA.1 U3.DTA.12 U4.DTA.2)
phB: LogicCircuits (R21.2 U14.8), DT2 (D5.DTB.1 R8.DTB.1 U3.DTB.12 U4.DTB.2)
phB: LogicCircuits (R23.2 U15.3), DT3 (D5.DTC.1 R8.DTC.1 U3.DTC.12 U4.DTC.2)
phB: LogicCircuits (R25.2 U15.8), DT4 (D5.DTD.1 R8.DTD.1 U3.DTD.12 U4.DTD.2)
phT: LogicCircuits (R22.2 U14.11), DT2 (D8.DTB.1 R15.DTB.1 U3.DTB.1 U4.DTB.11)
phT: LogicCircuits (R19.2 U14.6), DT1 (D8.DTA.1 R15.DTA.1 U3.DTA.1 U4.DTA.11)
phT: LogicCircuits (R26.2 U15.11), DT4 (D8.DTD.1 R15.DTD.1 U3.DTD.1 U4.DTD.11)
phT: LogicCircuits (R24.2 U15.6), DT3 (D8.DTC.1 R15.DTC.1 U3.DTC.1 U4.DTC.11)